# Altium schematic sheet ALU_XOR.SchDoc
size B; Author: E. Sims; Organization: Let's Build Rockets Inc.; SheetNumber: 14; SheetTotal: 16
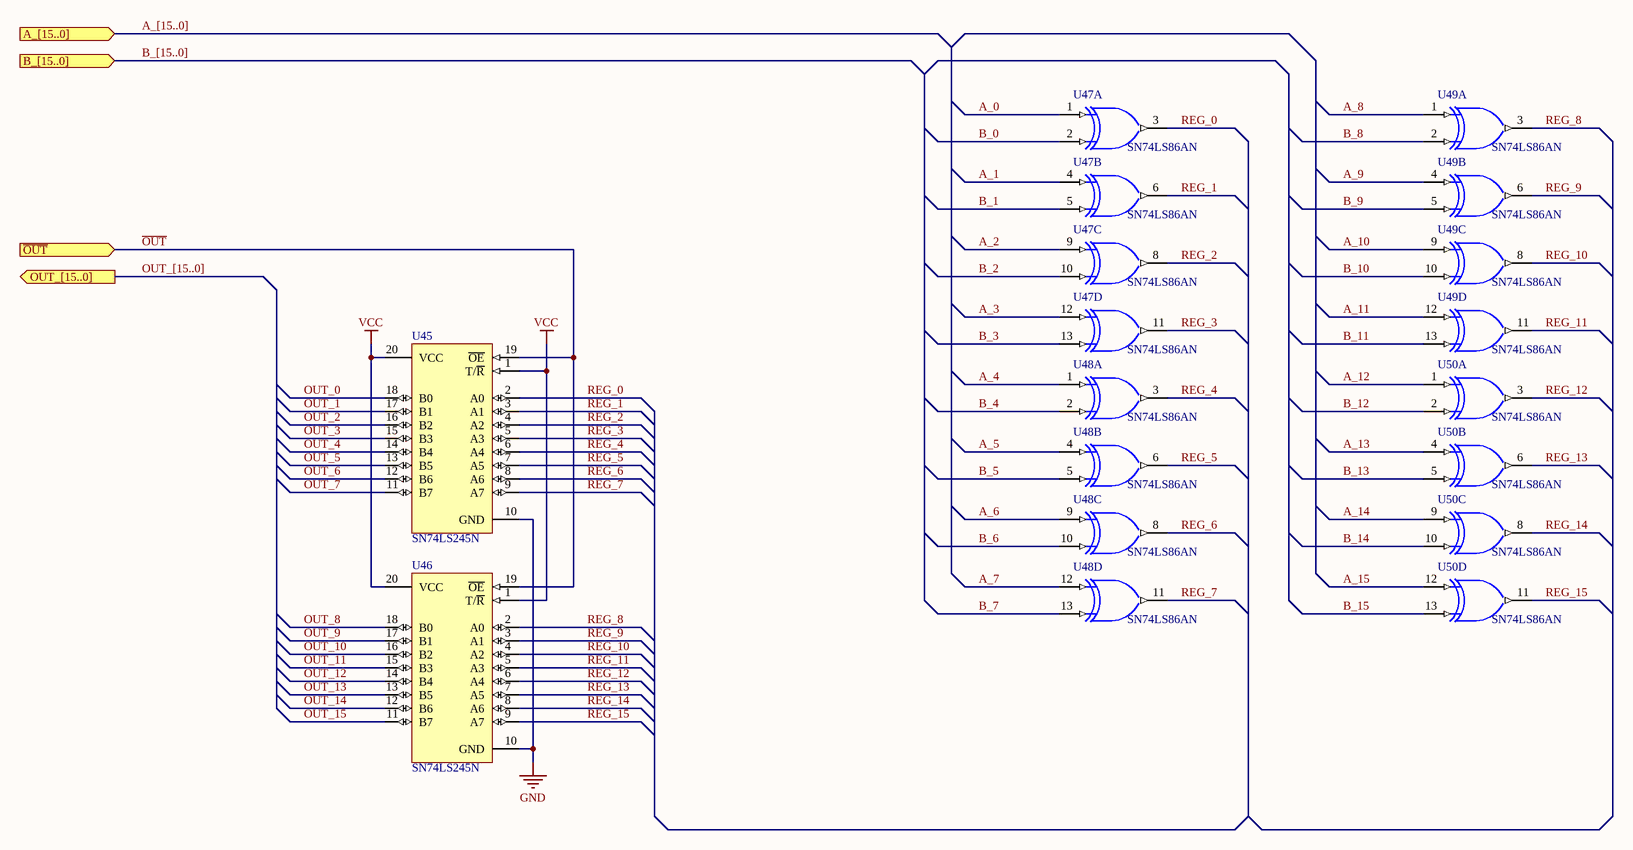
[diagram p0: ALU_XOR.SchDoc]

## Parts
U45  SN74LS245N  [N020]
U46  SN74LS245N  [N020]
U47  SN74LS86AN  [N014]  (parts A,B,C,D of 4)
U48  SN74LS86AN  [N014]  (parts A,B,C,D of 4)
U49  SN74LS86AN  [N014]  (parts A,B,C,D of 4)
U50  SN74LS86AN  [N014]  (parts A,B,C,D of 4)

## Ports
A_[15..0] (in), B_[15..0] (in), OUT_[15..0] (out), ~{OUT} (in)

## Nets
GND: U45.10(GND) U46.10(GND) U47.7(GND) U48.7(GND) U49.7(GND) U50.7(GND)
VCC: U45.1(T/~{R}) U45.20(VCC) U46.1(T/~{R}) U46.20(VCC) U47.14(VCC) U48.14(VCC) U49.14(VCC) U50.14(VCC)
A_0: U47.1(A)
A_1: U47.4(A)
A_2: U47.9(A)
A_3: U47.12(A)
A_4: U48.1(A)
A_5: U48.4(A)
A_6: U48.9(A)
A_7: U48.12(A)
A_8: U49.1(A)
A_9: U49.4(A)
A_10: U49.9(A)
A_11: U49.12(A)
A_12: U50.1(A)
A_13: U50.4(A)
A_14: U50.9(A)
A_15: U50.12(A)
B_0: U47.2(B)
B_1: U47.5(B)
B_2: U47.10(B)
B_3: U47.13(B)
B_4: U48.2(B)
B_5: U48.5(B)
B_6: U48.10(B)
B_7: U48.13(B)
B_8: U49.2(B)
B_9: U49.5(B)
B_10: U49.10(B)
B_11: U49.13(B)
B_12: U50.2(B)
B_13: U50.5(B)
B_14: U50.10(B)
B_15: U50.13(B)
~{OUT}: U45.19(~{OE}) U46.19(~{OE}) ; port ~{OUT}
OUT_0: U45.18(B0)
OUT_1: U45.17(B1)
OUT_2: U45.16(B2)
OUT_3: U45.15(B3)
OUT_4: U45.14(B4)
OUT_5: U45.13(B5)
OUT_6: U45.12(B6)
OUT_7: U45.11(B7)
OUT_8: U46.18(B0)
OUT_9: U46.17(B1)
OUT_10: U46.16(B2)
OUT_11: U46.15(B3)
OUT_12: U46.14(B4)
OUT_13: U46.13(B5)
OUT_14: U46.12(B6)
OUT_15: U46.11(B7)
REG_0: U45.2(A0) U47.3(Y)
REG_1: U45.3(A1) U47.6(Y)
REG_2: U45.4(A2) U47.8(Y)
REG_3: U45.5(A3) U47.11(Y)
REG_4: U45.6(A4) U48.3(Y)
REG_5: U45.7(A5) U48.6(Y)
REG_6: U45.8(A6) U48.8(Y)
REG_7: U45.9(A7) U48.11(Y)
REG_8: U46.2(A0) U49.3(Y)
REG_9: U46.3(A1) U49.6(Y)
REG_10: U46.4(A2) U49.8(Y)
REG_11: U46.5(A3) U49.11(Y)
REG_12: U46.6(A4) U50.3(Y)
REG_13: U46.7(A5) U50.6(Y)
REG_14: U46.8(A6) U50.8(Y)
REG_15: U46.9(A7) U50.11(Y)

## Buses and harness runs
bus A_[15..0] = port A_[15..0]
bus B_[15..0] = port B_[15..0]
bus OUT_[15..0] = port OUT_[15..0]

## Notes on the sheet
- Let's Build Rocket's Inc. Modular Paylaod System Based on TMP-010 Rev
  For more information visit https://github.com/LetsBuildRockets/Modular-Payload-System
  This work is licensed under CC BY-NC 4.0. To view a copy of this license, visit https://creativecommons.org/licenses/by-nc/4.0
- Title
- Size:
- Date:
- Assembly Variant:
- B
- Number:
- Time:
- Revision:
- Sheet
- of
- Author:
- File:

## Library data of the parts
U45 U46 = SN74LS245N: Octal Bus Transceiver with 3-State Outputs; Published: 8-Jun-2000; LatestRevisionDate: 04-Mar-2005; LatestRevisionNote: Stylized 3D Model Added.; DatasheetVersion: Mar-1988; PackageVersion: Oct-1995; PackageReference: N020; Publisher: Altium Limited; PackageDescription: DIP; 20 Leads; Row Spacing 7.62 mm; Pitch 2.54 mm; ComponentLink1Description: Manufacturer Link; ComponentLink1URL: http://www.ti.com/; ComponentLink2Description: Datasheet; ComponentLink2URL: http://www-s.ti.com/sc/ds/sn74ls245.pdf
U47-U50 = SN74LS86AN: Quadruple 2-Input Exclusive-OR Gate; Published: 8-Jun-2000; LatestRevisionDate: 04-Mar-2005; LatestRevisionNote: Stylized 3D Model Added.; DatasheetVersion: Mar-1988; PackageVersion: Oct-1995; PackageReference: N014; Publisher: Altium Limited; PackageDescription: DIP; 14 Leads; Row Spacing 7.62 mm; Pitch 2.54 mm; ComponentLink1Description: Manufacturer Link; ComponentLink1URL: http://www.ti.com/; ComponentLink2Description: Datasheet; ComponentLink2URL: http://www-s.ti.com/sc/ds/sn74ls86a.pdf